# EAGLE schematic ESP-D1-mini-mainboard (EAGLE 9.6.2)
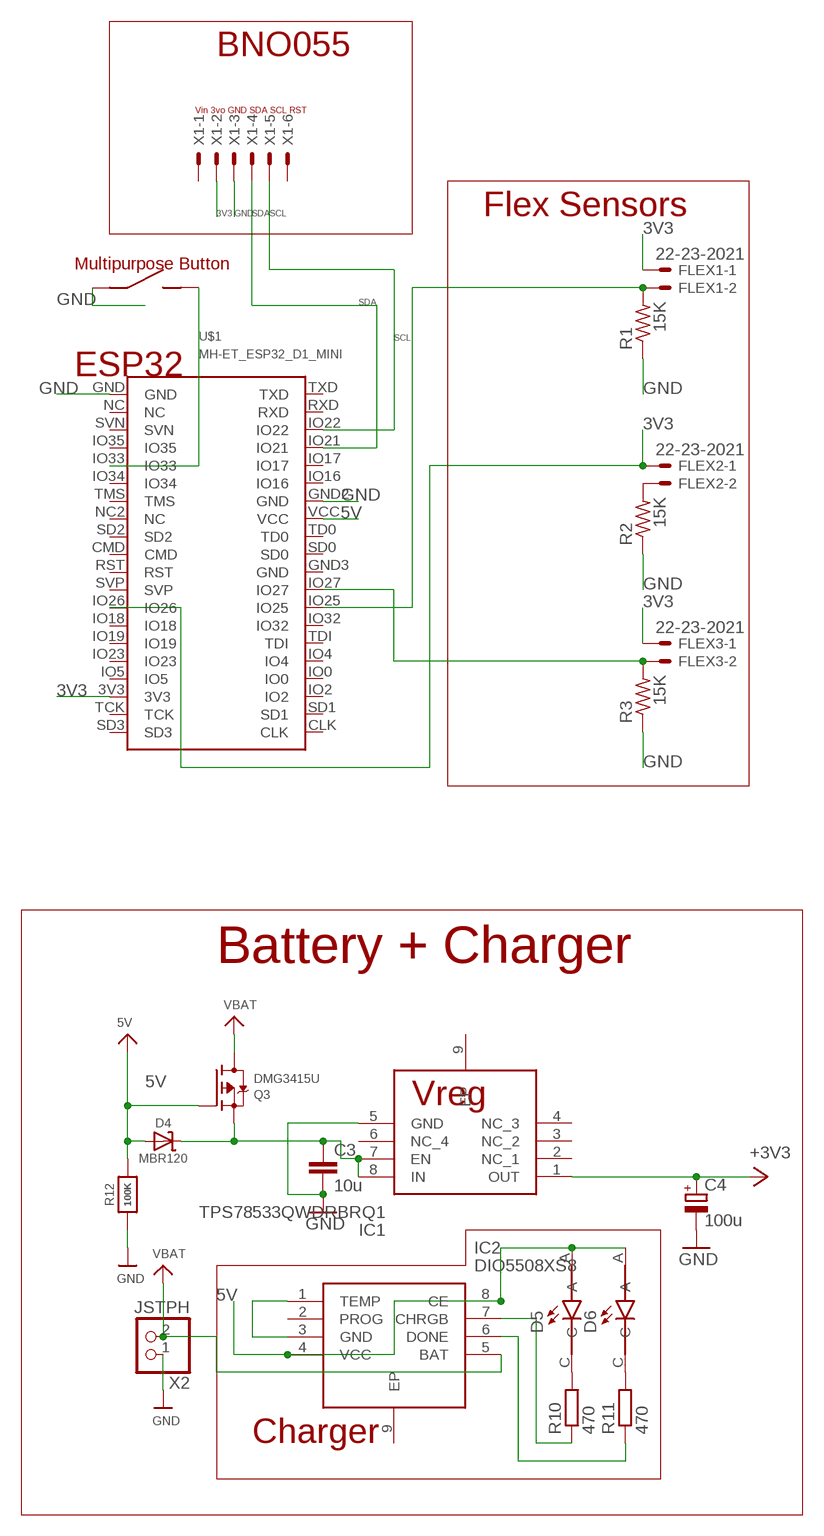
[diagram p0: schematic, sheet 1]

## Parts
BTN2  TS36CA-0.7  [SMD]
C3  10u  C-EUC0603  [C0603]
C4  100u  CPOL-EUB/3528-21W  [B/3528-21W]
D4  MBR120  DIODE-SCHOTTKYSOD-123  [SOD-123]
D5  GREEN  597-5311-402F  [LEDC2012X70N]
D6  GREEN  597-5311-402F  [LEDC2012X70N]
FLEX1  22-23-2021  [22-23-2021]
FLEX2  22-23-2021  [22-23-2021]
FLEX3  22-23-2021  [22-23-2021]
IC1  TPS78533QWDRBRQ1  [SON65P300X300X100-9N]
IC2  DIO5508XS8  [SOIC127P600X170-9N]
Q3  DMG3415U  MOSFET-P  [SOT23-R]
R1  15K  FLIPFLOP-RES  [0805-THM]
R2  15K  FLIPFLOP-RES  [0805-THM]
R3  15K  FLIPFLOP-RES  [0805-THM]
R10  470  R-EU_R0603  [R0603]
R11  470  R-EU_R0603  [R0603]
R12  100K  RESISTOR_0603_NOOUT  [0603-NO]
U$1  MH-ET_ESP32_D1_MINI  [MH-ET_ESP32_D1_MINI]
X1  22-23-2061  [22-23-2061]
X2  JSTPH  CON_JST_PH_2PIN  [JSTPH2]

## Nets
3V3: FLEX1.1 FLEX2.1 FLEX3.1 U$1.3V3 U$1.IO26 X1.2
5V: D4.A D5.A D6.A IC2.4(VCC) IC2.8(CE) Q3.1(G) R12.2 U$1.VCC
+3V3 [VCC]: C4.+ IC1.1(OUT)
GND: BTN2.A(CASE) BTN2.B(CASE) BTN2.C C3.2 C4.- IC1.5(GND) R1.1 R2.1 R3.1 R12.1 U$1.GND U$1.GND2(GND) X1.3 X2.1
N$6: FLEX1.2 R1.2 U$1.IO25
N$7: FLEX2.2 R2.2
N$8: FLEX3.2 R3.2 U$1.IO27
N$11: BTN2.D U$1.IO33
N$13: IC2.1(TEMP) IC2.3(GND)
N$14: D5.C R10.2
N$15: D6.C R11.2
N$16: IC2.7(CHRGB) R10.1
N$17: IC2.6(DONE) R11.1
N$18: C3.1 D4.C IC1.7(EN) IC1.8(IN) Q3.2(S)
SCL: U$1.IO22 X1.5
SDA: U$1.IO21 X1.4
VBAT: IC2.5(BAT) Q3.3(D) X2.2
Unconnected: IC1.2(NC_1) IC1.3(NC_2) IC1.4(NC_3) IC1.6(NC_4) IC1.9(EP) IC2.2(PROG) IC2.9(EP) U$1.CLK U$1.CMD U$1.GND3(GND) U$1.IO0 U$1.IO2 U$1.IO4 U$1.IO5 U$1.IO16 U$1.IO17 U$1.IO18 U$1.IO19 U$1.IO23 U$1.IO32 U$1.IO34 U$1.IO35 U$1.NC U$1.NC2(NC) U$1.RST U$1.RXD U$1.SD0 U$1.SD1 U$1.SD2 U$1.SD3 U$1.SVN U$1.SVP U$1.TCK U$1.TD0 U$1.TDI U$1.TMS U$1.TXD X1.1 X1.6

## Notes on the sheet
- BNO055
- Vin 3vo GND SDA SCL RST
- Flex Sensors
- Multipurpose Button
- ESP32
- Battery + Charger
- Vreg
- Charger

## Library data of the parts
BTN2 = SMD Tact:TS36CA-0.7: SHOU HAN TS36CA-0.7; LCSC#: C412365; MF: SHOU HAN; MP: TS36CA-0.7
C3 = rcl:C-EU: CAPACITOR, European symbol; SPICEPREFIX: C
C4 = rcl:CPOL-EU: POLARIZED CAPACITOR, European symbol; SPICEPREFIX: C
D4 = microbuilder:DIODE-SCHOTTKY
D5 D6 = 597-5311-402F:597-5311-402F: LED Uni-Color Green 560nm 2-Pin Chip 0805(2012Metric) Strip; AVAILABILITY: Unavailable; DESCRIPTION: LED Uni-Color Green 560nm 2-Pin Chip 0805_2012Metric_ Tape; MF: Dialight; MP: 597-5311-402F; PACKAGE: 0805 Dialight; PRICE: None
FLEX1-FLEX3 = con-molex:22-23-2021: .100" (2.54mm) Center Header - 2 Pin; MF: MOLEX; MPN: 22-23-2021; OC_FARNELL: 1462926; OC_NEWARK: 25C3832
IC1 = TPS78533QWDRBRQ1:TPS78533QWDRBRQ1: LDO Voltage Regulators Automotive, 1-A, high-accuracy, adjustable low-dropout (LDO) linear regulator Source: Datasheet <https://www.arrow.com/en/products/tps78533qwdrbrq1/texas-instruments?region=nac>; DESCRIPTION: LDO Voltage Regulators Automotive, 1-A, high-accuracy, adjustable low-dropout (LDO) linear regulator; HEIGHT: 1mm; MANUFACTURER_NAME: Texas Instruments; MANUFACTURER_PART_NUMBER: TPS78533QWDRBRQ1; MOUSER_PART_NUMBER: 595-TPS78533QWDRBRQ1; MOUSER_PRICE-STOCK: https://www.mouser.co.uk/ProductDetail/Texas-Instruments/TPS78533QWDRBRQ1?qs=iLbezkQI%252BsiNbdqh2Ko9GQ%3D%3D
IC2 = DIO5508XS8:DIO5508XS8: Battery Management 1A Lithium Ion Battery Charger IC Source: Datasheet <https://www.mouser.co.uk/datasheet/2/802/dimi_s_a0009242516_1-2295248.pdf>; DESCRIPTION: Battery Management 1A Lithium Ion Battery Charger IC; HEIGHT: 1.7mm; MANUFACTURER_NAME: DIOO Microcircuits; MANUFACTURER_PART_NUMBER: DIO5508XS8; MOUSER_PART_NUMBER: 453-DIO5508XS8; MOUSER_PRICE-STOCK: https://www.mouser.co.uk/ProductDetail/DIOO-Microcircuits/DIO5508XS8?qs=wUXugUrL1qzPv8nEmpxvyA%3D%3D
Q3 = microbuilder:MOSFET-P: P-Channel Mosfet LEGEND VDS: Voltage Drain-Source ID: Drain Current RDS(ON): Drain-Source On-State Resistance VGS(TH): Gate-Source Threshold Voltage CISS: Drain-Source Input Capacitance SOT-23 Name VDS ID RDS(ON) VGS(TH) CISS Order Number IRLML5103 30V 760mA 600 mOhm -- 75pF @ 25V Digikey: IRLML5103PBFCT-ND IRLML6401 12V 4.3A 50 mOhm 950mV @ 250µA 830pF @ 10V Digikey: IRLML6401PBFTR-ND NTR0202PL 20V 400mA 800 mOhm 2.3V @ 250uA 70pF @ 5V Digikey: NTR0202PLT1GOSTR-ND NTR4101PT1G 20V 1.8A 85 mOhm 1.2V @ 250uA 675pF @ 10V Digikey: NTR4101PT1GOSCT-ND DMP2004K 20V 600mA 900 mOhm 1V @ 250uA 175pF @ 16V Digikey: DMP2004KDICT-ND PMV65XP 20V 3.9A 76 mOhm 950mV @ 1mA 725pF @ 20V Digikey: 568-2358-2-ND TO-252 Name VDS ID RDS(ON) VGS(TH) CISS Order Number AOD417 30V 25A 34 mOhm 3V @ 250µA 920pF @ 15V Digikey: 785-1106-2-ND PowerPak Name VDS ID RDS(ON) VGS(TH) CISS Order Number AON7401 30V 12A 14 mOhm 3V @ 250µA 2600pF @ 15V Digikey: 785-1302-1-ND
R1-R3 = adafruit:FLIPFLOP-RES: Flip Flop resistor An 0805 resistor inside a standard 1/4W 5% resistor. Makes for easy mods
R10 R11 = rcl:R-EU_: RESISTOR, European symbol; SPICEPREFIX: R
R12 = microbuilder:RESISTOR: Resistors For new designs, use the packages preceded by an '_' character since they are more reliable: The following footprints should be used on most boards: _0402 - Standard footprint for regular board layouts _0603 - Standard footprint for regular board layouts _0805 - Standard footprint for regular board layouts _1206 - Standard footprint for regular board layouts For extremely tight-pitch boards where space is at a premium, the following 'micro-pitch' footprints can be used (smaller pads, no silkscreen outline, etc.): _0402MP - Micro-pitch footprint for very dense/compact boards _0603MP - Micro-pitch footprint for very dense/compact boards _0805MP - Micro-pitch footprint for very dense/compact boards _1206MP - Micro-pitch footprint for very dense/compact boards
U$1 = MH-ET_ESP32_D1_MINI:MH-ET_ESP32_D1_MINI
X1 = con-molex:22-23-2061: .100" (2.54mm) Center Header - 6 Pin; MF: MOLEX; MPN: 22-23-2061; OC_FARNELL: 1462922; OC_NEWARK: 27C1933
X2 = microbuilder:CON_JST_PH_2PIN: JST 2-Pin Right-Angle Connector PH-Series - 4UConnector: 17311 SH-Series - 4UConnector: 07278

## Net classes
1 GND: width 0.4 mm
2 VCC: width 0.4 mm